# Altium schematic sheet Test_Jig_INTEL.SchDoc
size A2; DrawnBy: Philip Rowse
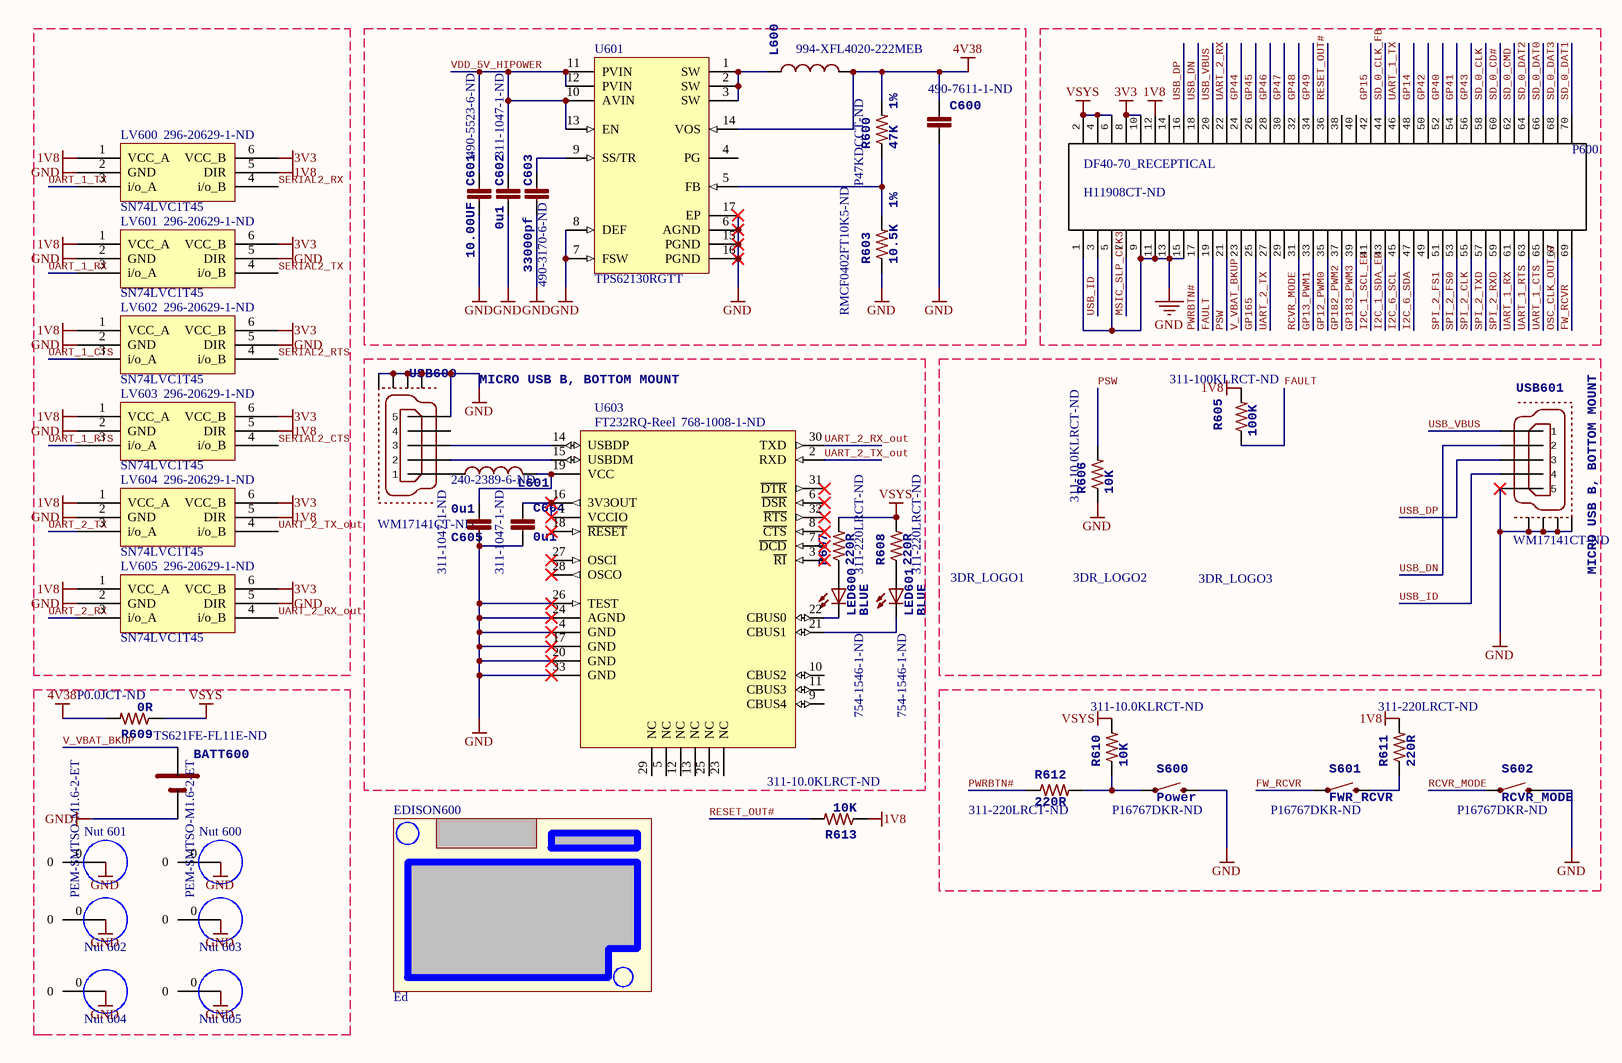
[diagram p0: Test_Jig_INTEL.SchDoc]

## Parts
3DR_LOGO1  (no value)  [3DR_Small]
3DR_LOGO2  (no value)  [3DR_smaller]
3DR_LOGO3  (no value)  [3DR_smaller]
BATT600  Supplier Part Number 1: TS621FE-FL11E-ND  [MS621FE]
C600  Supplier Part Number 1: 490-7611-1-ND  [0603-CAP]
C601  10.00UF  Supplier Part Number 1: 490-5523-6-ND  [0805-CAP]
C602  0u1  Supplier Part Number 1: 311-1047-1-ND  [0402-CAP]
C603  33000pf  Supplier Part Number 1: 490-3170-6-ND  [0402-CAP]
C604  0u1  Supplier Part Number 1: 311-1047-1-ND  [0402-CAP]
C605  0u1  Supplier Part Number 1: 311-1047-1-ND  [0402-CAP]
EDISON600  Ed  [ed]
L600  Supplier Part Number 1: 994-XFL4020-222MEB  [XFL4020]  (hidden comment: XFL4020-222MEB)
L601  Supplier Part Number 1: 240-2389-6-ND  [0805-IND]
LED600  BLUE  Supplier Part Number 1: 754-1546-1-ND  [0603-LED-Blue]
LED601  BLUE  Supplier Part Number 1: 754-1546-1-ND  [0603-LED-Blue]
LV600  SN74LVC1T45  Supplier Part Number 1: 296-20629-1-ND  [DRL]
LV601  SN74LVC1T45  Supplier Part Number 1: 296-20629-1-ND  [DRL]
LV602  SN74LVC1T45  Supplier Part Number 1: 296-20629-1-ND  [DRL]
LV603  SN74LVC1T45  Supplier Part Number 1: 296-20629-1-ND  [DRL]
LV604  SN74LVC1T45  Supplier Part Number 1: 296-20629-1-ND  [DRL]
LV605  SN74LVC1T45  Supplier Part Number 1: 296-20629-1-ND  [DRL]
Nut_600  PEM-SMTSO-M1.6-2-ET  [PEM-SMTSO-M1.6-2-ET]
Nut_601  PEM-SMTSO-M1.6-2-ET  [PEM-SMTSO-M1.6-2-ET]
Nut_602  PEM-SMTSO-M1.6-2-ET  [PEM-SMTSO-M1.6-2-ET]  (value not drawn)
Nut_603  PEM-SMTSO-M1.6-2-ET  [PEM-SMTSO-M1.6-2-ET]  (value not drawn)
Nut_604  PEM-SMTSO-M1.6-2-ET  [PEM-SMTSO-M1.6-2-ET]  (value not drawn)
Nut_605  PEM-SMTSO-M1.6-2-ET  [PEM-SMTSO-M1.6-2-ET]  (value not drawn)
P600  DF40-70_RECEPTICAL  Supplier Part Number 1: H11908CT-ND  [DF40-70_RECEPTICAL]
R600  47K  1%  Supplier Part Number 1: P47KDCCT-ND  [0402-RES]
R603  10.5K  1%  Supplier Part Number 1: RMCF0402FT10K5-ND  [0402-RES]
R605  100K  Supplier Part Number 1: 311-100KLRCT-ND  [0402-RES]
R606  10K  Supplier Part Number 1: 311-10.0KLRCT-ND  [0402-RES]
R607  220R  Supplier Part Number 1: 311-220LRCT-ND  [0402-RES]
R608  220R  Supplier Part Number 1: 311-220LRCT-ND  [0402-RES]
R609  0R  Supplier Part Number 1: P0.0JCT-ND  [0402-RES]
R610  10K  Supplier Part Number 1: 311-10.0KLRCT-ND  [0402-RES]
R611  220R  Supplier Part Number 1: 311-220LRCT-ND  [0402-RES]
R612  220R  Supplier Part Number 1: 311-220LRCT-ND  [0402-RES]
R613  10K  Supplier Part Number 1: 311-10.0KLRCT-ND  [0402-RES]
S600  Power  Supplier Part Number 1: P16767DKR-ND  [EVQP7J01K]
S601  FWR_RCVR  Supplier Part Number 1: P16767DKR-ND  [EVQP7J01K]
S602  RCVR_MODE  Supplier Part Number 1: P16767DKR-ND  [EVQP7J01K]
U601  TPS62130RGTT  [RGT16-1700X1700TP]
U603  FT232RQ-Reel  Supplier Part Number 1: 768-1008-1-ND  [PQFN5X5-32_V]
USB600  MICRO USB B, BOTTOM MOUNT  Supplier Part Number 1: WM17141CT-ND  [MOLEX-47346-0001]
USB601  MICRO USB B, BOTTOM MOUNT  Supplier Part Number 1: WM17141CT-ND  [MOLEX-47346-0001]

## Nets
1V8: LV600.1(VCC_A) LV600.5(DIR) LV601.1(VCC_A) LV602.1(VCC_A) LV603.1(VCC_A) LV603.5(DIR) LV604.1(VCC_A) LV604.5(DIR) LV605.1(VCC_A) P600.12(P$12) R605.P$2 R611.P$2 R613.P$1
3V3: LV600.6(VCC_B) LV601.6(VCC_B) LV602.6(VCC_B) LV603.6(VCC_B) LV604.6(VCC_B) LV605.6(VCC_B) P600.8(P$8) P600.10(P$10)
4V38: C600.P$1 L600.P$2 R600.P$2 R609.P$2 U601.14(VOS)
GND: BATT600.2(NEG) C600.P$2 C601.P$2 C602.P$2 C603.P$2 C604.P$2 C605.P$2 LV600.2(GND) LV601.2(GND) LV601.5(DIR) LV602.2(GND) LV602.5(DIR) LV603.2(GND) LV604.2(GND) LV605.2(GND) LV605.5(DIR) Nut_600.0 Nut_601.0 Nut_602.0 Nut_603.0 Nut_604.0 Nut_605.0 P600.1(P$1) P600.5(P$5) P600.9(P$9) P600.11(P$11) P600.13(P$13) P600.15(P$15) R603.P$1 R606.P$1 S600.B3 S602.B3 U601.6(AGND) U601.7(FSW) U601.8(DEF) U601.15(PGND) U601.16(PGND) U601.17(EP) U603.4(GND) U603.17(GND) U603.20(GND) U603.24(AGND) U603.26(TEST) U603.33(GND) USB600.GND(5) USB600.GND1 USB600.GND2 USB600.GND3 USB600.GND4 USB601.GND(5) USB601.GND1 USB601.GND2 USB601.GND3 USB601.GND4
VSYS: P600.2(P$2) P600.4(P$4) P600.6(P$6) R607.P$2 R608.P$2 R609.P$1 R610.P$2
FAULT: P600.19(P$19) R605.P$1
FW_RCVR: P600.69(P$69) S601.A1
GP12_PWM0: P600.35(P$35)
GP13_PWM1: P600.33(P$33)
GP14: P600.48(P$48)
GP15: P600.42(P$42)
GP40: P600.52(P$52)
GP41: P600.54(P$54)
GP42: P600.50(P$50)
GP43: P600.56(P$56)
GP44: P600.24(P$24)
GP45: P600.26(P$26)
GP46: P600.28(P$28)
GP47: P600.30(P$30)
GP48: P600.32(P$32)
GP49: P600.34(P$34)
GP165: P600.25(P$25)
GP182_PWM2: P600.37(P$37)
GP183_PWM3: P600.39(P$39)
I2C_1_SCL_ED: P600.41(P$41)
I2C_1_SDA_ED: P600.43(P$43)
I2C_6_SCL: P600.45(P$45)
I2C_6_SDA: P600.47(P$47)
MSIC_SLP_CLK3: P600.7(P$7)
OSC_CLK_OUT_0: P600.67(P$67)
PSW: P600.21(P$21) R606.P$2
PWRBTN#: P600.17(P$17) R612.P$1
RCVR_MODE: P600.31(P$31) S602.A1
RESET_OUT#: P600.36(P$36) R613.P$2
SD_0_CD#: P600.60(P$60)
SD_0_CLK: P600.58(P$58)
SD_0_CLK_FB: P600.44(P$44)
SD_0_CMD: P600.62(P$62)
SD_0_DAT0: P600.66(P$66)
SD_0_DAT1: P600.70(P$70)
SD_0_DAT2: P600.64(P$64)
SD_0_DAT3: P600.68(P$68)
SERIAL2_CTS: LV603.4(i/o_B)
SERIAL2_RTS: LV602.4(i/o_B)
SERIAL2_RX: LV600.4(i/o_B)
SERIAL2_TX: LV601.4(i/o_B)
SPI_2_CLK: P600.55(P$55)
SPI_2_FS0: P600.53(P$53)
SPI_2_FS1: P600.51(P$51)
SPI_2_RXD: P600.59(P$59)
SPI_2_TXD: P600.57(P$57)
UART_1_CTS: LV602.3(i/o_A) P600.65(P$65)
UART_1_RTS: LV603.3(i/o_A) P600.63(P$63)
UART_1_RX: LV601.3(i/o_A) P600.61(P$61)
UART_1_TX: LV600.3(i/o_A) P600.46(P$46)
UART_2_RX: LV605.3(i/o_A) P600.22(P$22)
UART_2_RX_out: LV605.4(i/o_B) U603.30(TXD)
UART_2_TX: LV604.3(i/o_A) P600.27(P$27)
UART_2_TX_out: LV604.4(i/o_B) U603.2(RXD)
USB_DN: P600.18(P$18) USB601.D-(2)
USB_DP: P600.16(P$16) USB601.D+(3)
USB_ID: P600.3(P$3) USB601.ID(4)
USB_VBUS: P600.20(P$20) USB601.VBUS(1)
V_VBAT_BKUP: BATT600.1(POS) P600.23(P$23)
VDD_5V_HIPOWER: C601.P$1 C602.P$1 U601.10(AVIN) U601.11(PVIN) U601.12(PVIN) U601.13(EN)
NetC603_P$1: C603.P$1 U601.9(SS/TR)
NetC604_P$1: C604.P$1 U603.1(VCCIO) U603.16(3V3OUT)
NetC605_P$1: C605.P$1 L601.P$2 U603.19(VCC)
NetL600_P$1: L600.P$1 U601.1(SW) U601.2(SW) U601.3(SW)
NetL601_P$1: L601.P$1 USB600.VBUS(1)
NetLED600_A: LED600.A R607.P$1
NetLED600_C: LED600.C U603.22(CBUS0)
NetLED601_A: LED601.A R608.P$1
NetLED601_C: LED601.C U603.21(CBUS1)
NetR600_P$1: R600.P$1 R603.P$2 U601.5(FB)
NetR610_P$1: R610.P$1 R612.P$2 S600.A1
NetR611_P$1: R611.P$1 S601.B3
NetU603_14: U603.14(USBDP) USB600.D+(3)
NetU603_15: U603.15(USBDM) USB600.D-(2)

Not connected (* = marked no-connect by the designer): P600 14(P$14) 29(P$29) 38(P$38) 40(P$40) 49(P$49); U601 4(PG); U603 3(~{RI})* 5(NC) 6(~{DSR})* 7(~{DCD})* 8(~{CTS})* 9(CBUS4) 10(CBUS2) 11(CBUS3) 12(NC) 13(NC) 18(~{RESET})* 23(NC) 25(NC) 27(OSCI)* 28(OSCO)* 29(NC) 31(~{DTR})* 32(~{RTS})*; USB600 ID(4)

## Notes on the sheet
- Title
- Size:
- Date:
- File:
- A2
- Number:
- Time:
- Revision:
- Sheet
- of

## Library data of the parts
3DR_LOGO1-3DR_LOGO3 = 3DR_LOGO: DO NOT PLACE
BATT600 = MS621FE: MFGPN: TS621FE; DATASHEET: http://speed.sii.co.jp/data/file_PRODUCT_MASTER_50112_TITLE_IMAGESP.pdf; LINK: http://search.digikey.com/us/en/products/MS621FE-FL11E/728-1057-ND/1889208; Supplier 1: Digikey
C600 = CAP0603: Supplier 1: Digi-Key
C601 = CAP0805: CAPC,X5R,0805,10.00UF,25.00V,+/-10%; Supplier 1: Digi-Key
C602 = CAP0402: Supplier 1: Digi-Key
C603 = CAP0402: CAPC,X5R,0402,0.033UF,6.3V,+/- 10%; Supplier 1: Digi-Key
C604 C605 = CAP0402: <b>Capacitor</b> / Standard 0603 ceramic capacitor, and 0.1" leaded capacitor.; PARTNO: CC0402ZRY5V7BB104; Supplier 1: Digi-Key
L600 = INDUCTOR-XFL4020: pin to pad: P$1>1 P$2>2; PARTNUM: XFL4020-222MEB; Supplier 1: Mouser
L601 = INDUCTOR0805: Supplier 1: Digi-Key
LED600 LED601 = LED0603: <b>LEDs</b> / Standard schematic elements and footprints for 5mm, 3mm, 1206, and 0603 sized LEDs. 5mm - Spark Fun Electronics SKU : COM-00529 (and others); PARTNO: APTD1608QBC/D; Supplier 1: Digi-Key
Nut_600-Nut_605 = PEM-SMTSO-M1.6-2-ET: Fastener, M1.6x0.35mm, 8.00MM Pitch, SMTSO, CS; Mfg Part Num (Alternate): Check; Manufacturer 1: PennEngineering; 3DR_PARTNO: PRT0438; Supplier Part Number 1: PEM-SMTSO-M1.6-2-ET; Supplier 1: PennEngineering; Manufacturer Part Number 1: PEM-SMTSO-M1.6-2-ET; Supplier Unit Price 1: 0.7
R600 R603 R609 = RESISTOR0402-RES: Supplier 1: Digi-Key
R605 R606 R610-R613 = RESISTOR0402-RES: PARTNO: RC0402FR-07220RL; Supplier 1: Digi-Key
R607 R608 = RESISTOR0402-RES: <b>Resistor</b> / Basic schematic elements and footprints for 0603, 1206, and PTH 1/10th watt (small) resistors.; PARTNO: RC0402FR-07220RL; Supplier 1: Digi-Key
S600-S602 = SWITCH-MOMENTARY-2: Supplier 1: Digi-Key
U601 = TPS62130RGTT: Buck Step Down Regulator with 3 to 17 V Input and 0.9 to 6 V Output, -40 to 85 degC, 16-Pin QFN (RGT), Green (RoHS & no Sb/Br); Manufacturer: Texas Instruments; Duty Cycle(Max)(%): 100; Iout(Max)(A): 3; Iq(Typ)(mA): 0.017; Rating: Catalog; Regulated Outputs(#): 1; SubFamily: Step-Down Regulator; Switch Current Limit(Typ)(A): 4.2; Synchronous Rectification: TRUE; Vin(Max)(V): 17; Vout(Max)(V): 6; Vout(Min)(V): 0.9; DatasheetVersion: SLVSAG7; PackageVersion: revH, Oct-2011; PackageReference: RGT16-1700X1700TP; PackageDescription: 16-Pin Plastic Quad Flat No-Lead, 3 x 3 mm Body, 0.5 mm Pitch, 1.7 x 1.7 mm Exposed Pad; Supplier 1: Digi-Key; Supplier Part Number 1: 296-29934-2-ND; Supplier 2: Digi-Key; Supplier Part Number 2: 296-29934-1-ND; Supplier 3: Digi-Key; Supplier Part Number 3: 296-29934-6-ND; Supplier 4: Newark; Supplier Part Number 4: 74T5527; Supplier 5: Mouser; Supplier Part Number 5: 595-TPS62130RGTT; Eco-Plan: Green (RoHS & no Sb/Br); Topology: Buck; Vin(Min)(V): 3; Mounting Technology: Surface Mount; Code_JEDEC: MO-220; PartNumber: TPS62130RGTT; ComponentLink1Description: Datasheet; ComponentLink1URL: http://www.ti.com/general/docs/lit/getliterature.tsp?genericPartNumber=TPS62130&fileType=pdf; ComponentLink2Description: Package Specification; ComponentLink2URL: http://www.ti.com/litv/pdf/mpqf119g; ComponentLink3Description: URL Link1; ComponentLink3URL: Samples URL:http://www.ti.com/product/tps54611#samples
U603 = FT232RQ-Reel: USB UART Asynchronous Serial Data Transfer Chip, 32-pin QFN, Tape and Reel; Manufacturer: FTDI; DatasheetVersion: ver 2.10, Mar-2012; PackageVersion: Mar-12; PackageReference: PQFN5X5-32; PackageDescription: 32-Pin Quad Flat No-Lead 0.5 mm Pitch, Pullback, 3.2 x 3.2 mm Exposed Pad; PartNumber: FT232RQ-Reel; ComponentLink1Description: Manufacturer URL; ComponentLink1URL: http://www.ftdichip.com/; ComponentLink2Description: Datasheet; ComponentLink2URL: http://www.ftdichip.com/Support/Documents/DataSheets/ICs/DS_FT232R.pdf; Supplier 1: Digi-Key
USB600 USB601 = MOLEX-47346-0001: Supplier 1: Digi-Key
LV600-LV605 = SN74LVC1T45: Supplier 1: Digi-Key
P600 = DF40-70_RECEPTICAL: Supplier 1: Digi-Key